# Altium schematic sheet PROC106B_AOP_PWR.SchDoc: AOP_POWER
size 431 x 279 mm; Date: Not shown in title block; ApprovedBy: Not shown in title block; CheckedBy: Not shown in title block; Author: Not shown in title block; CompanyName: Not shown in title block; DrawnBy: Antony/Anand Ram; Engineer: Not shown in title block; Organization: Not shown in title block; Address1: Not shown in title block; Address2: Not shown in title block; Address3: Not shown in title block; Address4: Not shown in title block; DocumentNumber: 4; Revision: Use project parameter SCH_Rev; SheetNumber: 4; SheetTotal: 12; PageSetup: Record=PageOptions|CenterHorizontal=True|CenterVertical=True|PrintScale=1.00|XCorrection=1.00|YCorrection=1.00|PrintKind=0|BorderSize=5000000|LeftOffset=0|BottomOffset=0|Orientation=2|PaperLength=1000|PaperWidth=1000|Scale=100|PaperSource=15|PrintQuality=600|MediaType=1|DitherType=10|PaperKind=Letter|PrintScaleMode=1; CurrentTime: Not shown in title block; CurrentDate: Not shown in title block; Time: Not shown in title block; DocumentFullPathAndName: Not shown in title block; DocumentName: Not shown in title block; ModifiedDate: Not shown in title block; ImagePath: Not shown in title block
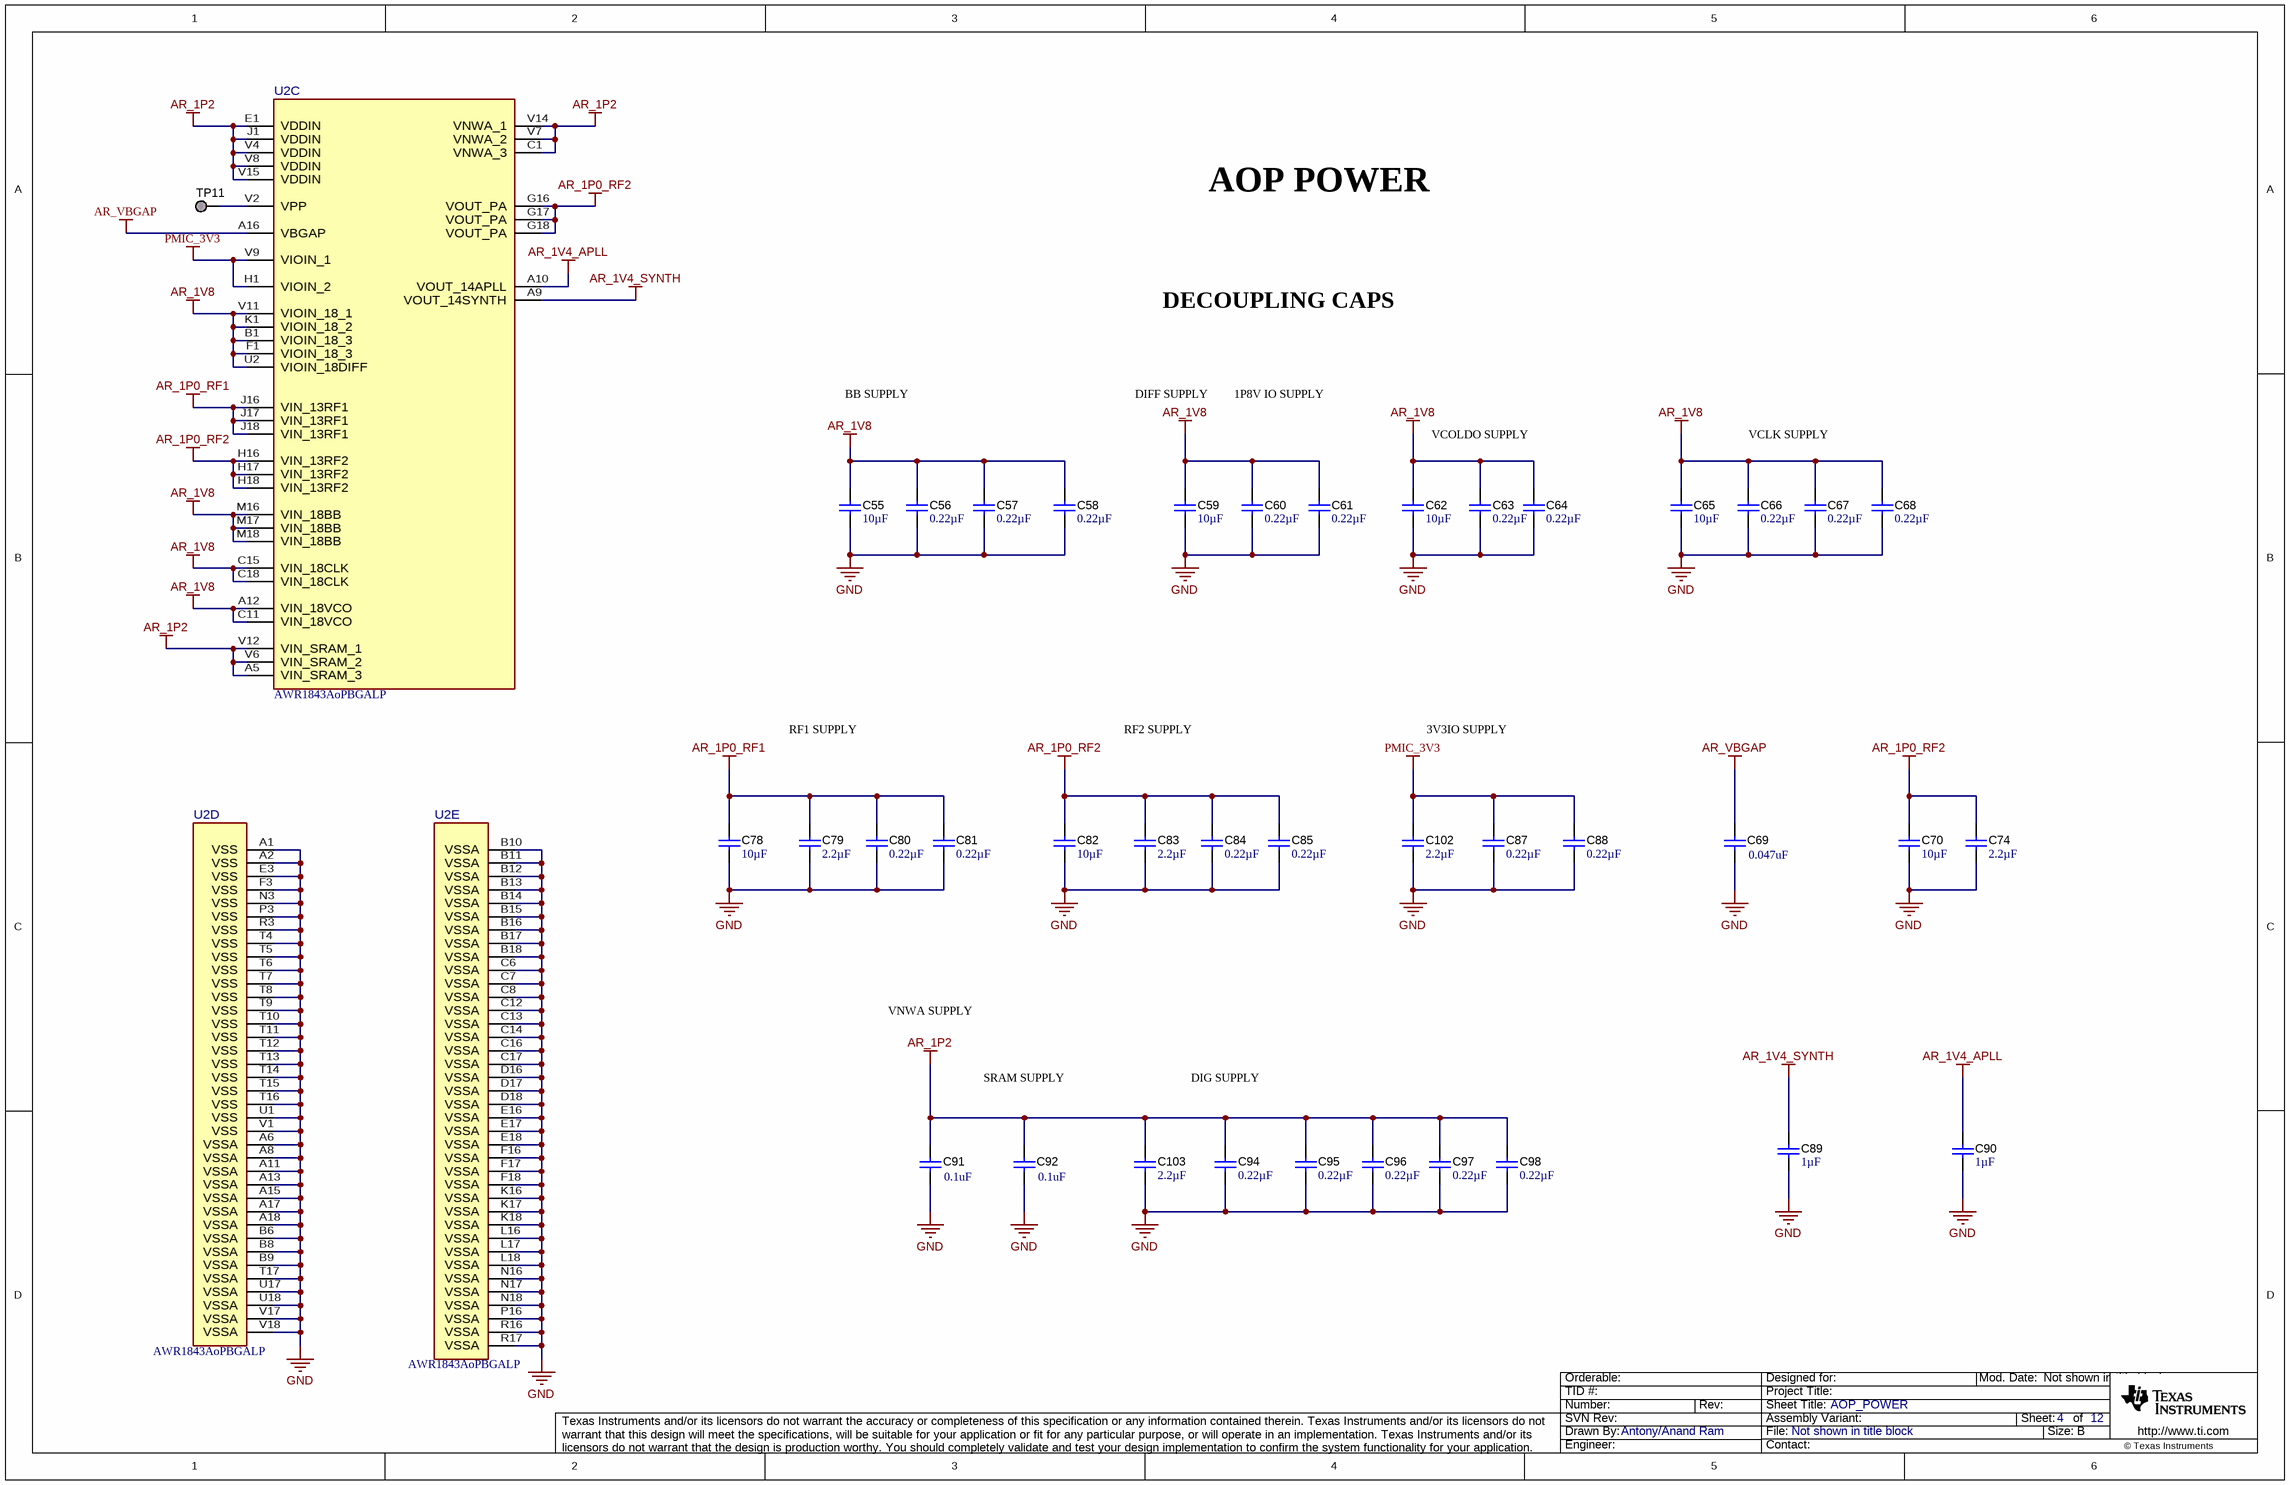
[diagram p0: PROC106B_AOP_PWR.SchDoc]

## Parts
C55  Cap_F: 10µF  [0805L]  (hidden comment: GCM21BR71A106KE22L)
C56  ValueDisplayed: 0.22µF  [0402L]  (hidden comment: GCM155R71C224KE02D)
C57  ValueDisplayed: 0.22µF  [0402L]  (hidden comment: GCM155R71C224KE02D)
C58  ValueDisplayed: 0.22µF  [0402L]  (hidden comment: GCM155R71C224KE02D)
C59  Cap_F: 10µF  [0805L]  (hidden comment: GCM21BR71A106KE22L)
C60  ValueDisplayed: 0.22µF  [0402L]  (hidden comment: GCM155R71C224KE02D)
C61  ValueDisplayed: 0.22µF  [0402L]  (hidden comment: GCM155R71C224KE02D)
C62  Cap_F: 10µF  [0805L]  (hidden comment: GCM21BR71A106KE22L)
C63  ValueDisplayed: 0.22µF  [0402L]  (hidden comment: GCM155R71C224KE02D)
C64  ValueDisplayed: 0.22µF  [0402L]  (hidden comment: GCM155R71C224KE02D)
C65  Cap_F: 10µF  [0805L]  (hidden comment: GCM21BR71A106KE22L)
C66  ValueDisplayed: 0.22µF  [0402L]  (hidden comment: GCM155R71C224KE02D)
C67  ValueDisplayed: 0.22µF  [0402L]  (hidden comment: GCM155R71C224KE02D)
C68  ValueDisplayed: 0.22µF  [0402L]  (hidden comment: GCM155R71C224KE02D)
C69  ValueDisplayed: 0.047uF  [0402L]  (hidden comment: CGA2B3X7R1H473K050BB)
C70  Cap_F: 10µF  [0805L]  (hidden comment: GCM21BR71A106KE22L)
C74  Cap_F: 2.2µF  [0603L]  (hidden comment: GCM188R70J225KE22D)
C78  Cap_F: 10µF  [0805L]  (hidden comment: GCM21BR71A106KE22L)
C79  Cap_F: 2.2µF  [0603L]  (hidden comment: GCM188R70J225KE22D)
C80  ValueDisplayed: 0.22µF  [0402L]  (hidden comment: GCM155R71C224KE02D)
C81  ValueDisplayed: 0.22µF  [0402L]  (hidden comment: GCM155R71C224KE02D)
C82  Cap_F: 10µF  [0805L]  (hidden comment: GCM21BR71A106KE22L)
C83  Cap_F: 2.2µF  [0603L]  (hidden comment: GCM188R70J225KE22D)
C84  ValueDisplayed: 0.22µF  [0402L]  (hidden comment: GCM155R71C224KE02D)
C85  ValueDisplayed: 0.22µF  [0402L]  (hidden comment: GCM155R71C224KE02D)
C87  ValueDisplayed: 0.22µF  [0402L]  (hidden comment: GCM155R71C224KE02D)
C88  ValueDisplayed: 0.22µF  [0402L]  (hidden comment: GCM155R71C224KE02D)
C89  Cap_F: 1µF  [0603L]  (hidden comment: GCM188R71C105KA64D)
C90  Cap_F: 1µF  [0603L]  (hidden comment: GCM188R71C105KA64D)
C91  ValueDisplayed: 0.1uF  [0402L]  (hidden comment: GCM155R71C104KA55D)
C92  ValueDisplayed: 0.1uF  [0402L]  (hidden comment: GCM155R71C104KA55D)
C94  ValueDisplayed: 0.22µF  [0402L]  (hidden comment: GCM155R71C224KE02D)
C95  ValueDisplayed: 0.22µF  [0402L]  (hidden comment: GCM155R71C224KE02D)
C96  ValueDisplayed: 0.22µF  [0402L]  (hidden comment: GCM155R71C224KE02D)
C97  ValueDisplayed: 0.22µF  [0402L]  (hidden comment: GCM155R71C224KE02D)
C98  ValueDisplayed: 0.22µF  [0402L]  (hidden comment: GCM155R71C224KE02D)
C102  Cap_F: 2.2µF  [0603L]  (hidden comment: GCM188R70J225KE22D)
C103  Cap_F: 2.2µF  [0603L]  (hidden comment: GCM188R70J225KE22D)
TP11  TP_SM_1MM  [TP_SM_1MM]  (value not drawn)  (no BOM)
U2  AWR1843AoPBGALP  [ALP0180A-MFG]  (parts C,D,E of 5)

## Nets
AR_1P0_RF1: C78.1 C79.1 C80.1 C81.1 U2.J16(VIN_13RF1) U2.J17(VIN_13RF1) U2.J18(VIN_13RF1)
AR_1P0_RF2: C70.1 C74.1 C82.1 C83.1 C84.1 C85.1 U2.G16(VOUT_PA) U2.G17(VOUT_PA) U2.G18(VOUT_PA) U2.H16(VIN_13RF2) U2.H17(VIN_13RF2) U2.H18(VIN_13RF2)
AR_1P2: C91.2 C92.2 C94.1 C95.1 C96.1 C97.1 C98.1 C103.1 U2.A5(VIN_SRAM_3) U2.C1(VNWA_3) U2.E1(VDDIN) U2.J1(VDDIN) U2.V4(VDDIN) U2.V6(VIN_SRAM_2) U2.V7(VNWA_2) U2.V8(VDDIN) U2.V12(VIN_SRAM_1) U2.V14(VNWA_1) U2.V15(VDDIN)
AR_1V4_APLL: C90.1 U2.A10(VOUT_14APLL)
AR_1V4_SYNTH: C89.1 U2.A9(VOUT_14SYNTH)
AR_1V8: C55.1 C56.1 C57.1 C58.1 C59.1 C60.1 C61.1 C62.1 C63.1 C64.1 C65.1 C66.1 C67.1 C68.1 U2.A12(VIN_18VCO) U2.B1(VIOIN_18_3) U2.C11(VIN_18VCO) U2.C15(VIN_18CLK) U2.C18(VIN_18CLK) U2.F1(VIOIN_18_3) U2.K1(VIOIN_18_2) U2.M16(VIN_18BB) U2.M17(VIN_18BB) U2.M18(VIN_18BB) U2.U2(VIOIN_18DIFF) U2.V11(VIOIN_18_1)
AR_VBGAP: C69.1 U2.A16(VBGAP)
GND: C55.2 C56.2 C57.2 C58.2 C59.2 C60.2 C61.2 C62.2 C63.2 C64.2 C65.2 C66.2 C67.2 C68.2 C69.2 C70.2 C74.2 C78.2 C79.2 C80.2 C81.2 C82.2 C83.2 C84.2 C85.2 C87.2 C88.2 C89.2 C90.2 C91.1 C92.1 C94.2 C95.2 C96.2 C97.2 C98.2 C102.2 C103.2 U2.A1(VSS) U2.A2(VSS) U2.A6(VSSA) U2.A8(VSSA) U2.A11(VSSA) U2.A13(VSSA) U2.A15(VSSA) U2.A17(VSSA) U2.A18(VSSA) U2.B6(VSSA) U2.B8(VSSA) U2.B9(VSSA) U2.B10(VSSA) U2.B11(VSSA) U2.B12(VSSA) U2.B13(VSSA) U2.B14(VSSA) U2.B15(VSSA) U2.B16(VSSA) U2.B17(VSSA) U2.B18(VSSA) U2.C6(VSSA) U2.C7(VSSA) U2.C8(VSSA) U2.C12(VSSA) U2.C13(VSSA) U2.C14(VSSA) U2.C16(VSSA) U2.C17(VSSA) U2.D16(VSSA) U2.D17(VSSA) U2.D18(VSSA) U2.E3(VSS) U2.E16(VSSA) U2.E17(VSSA) U2.E18(VSSA) U2.F3(VSS) U2.F16(VSSA) U2.F17(VSSA) U2.F18(VSSA) U2.K16(VSSA) U2.K17(VSSA) U2.K18(VSSA) U2.L16(VSSA) U2.L17(VSSA) U2.L18(VSSA) U2.N3(VSS) U2.N16(VSSA) U2.N17(VSSA) U2.N18(VSSA) U2.P3(VSS) U2.P16(VSSA) U2.R3(VSS) U2.R16(VSSA) U2.R17(VSSA) U2.T4(VSS) U2.T5(VSS) U2.T6(VSS) U2.T7(VSS) U2.T8(VSS) U2.T9(VSS) U2.T10(VSS) U2.T11(VSS) U2.T12(VSS) U2.T13(VSS) U2.T14(VSS) U2.T15(VSS) U2.T16(VSS) U2.T17(VSSA) U2.U1(VSS) U2.U17(VSSA) U2.U18(VSSA) U2.V1(VSS) U2.V17(VSSA) U2.V18(VSSA)
PMIC_3V3: C87.1 C88.1 C102.1 U2.H1(VIOIN_2) U2.V9(VIOIN_1)
NetTP11_1: TP11.1 U2.V2(VPP)

## Notes on the sheet
- AOP POWER
- DECOUPLING CAPS
- BB SUPPLY
- DIFF SUPPLY
- 1P8V IO SUPPLY
- VCOLDO SUPPLY
- VCLK SUPPLY
- RF1 SUPPLY
- RF2 SUPPLY
- 3V3IO SUPPLY
- VNWA SUPPLY
- SRAM SUPPLY
- DIG SUPPLY
- Drawn By:
- SVN Rev:
- Number:
- TID #:
- Orderable:
- Rev:
- Sheet Title:
- File:
- Project Title:
- Designed for:
- Assembly Variant:
- Mod. Date:
- Sheet:
- Size:
- of
- B
- http://www.ti.com
- Texas Instruments and/or its licensors do not warrant the accuracy or completeness of this specification or any information contained therein. Texas Instruments and/or its licensors do not warrant that this design will meet the specifications, will be suitable for your application or fit for any particular purpose, or will operate in an implementation. Texas Instruments and/or its licensors do not warrant that the design is production worthy. You should completely validate and test your design implementation to confirm the system functionality for your application.
- Engineer:
- Contact:
- © Texas Instruments

## Library data of the parts
C55 C59 C62 C65 C70 C78 C82 = CMP-0008017-2: CAP, CERM, 10 uF, 10 V, +/- 10%, X7R, 0805; Manufacturer: MuRata; Value: 10uF; AEC Category: Q200; Cap_Case: 0805; Polarized: N; SizeArea_mm2: 2.5; SizeAreaWB_mm2: 6.75; SizeX_mm: 2; SizeY_mm: 1.25; SizeZ_mm: 1.45; TaMax_C: 125°C; TaMin_C: -55°C; U/M: EA; Value1: Unknown; Value2: 10V; RoHS: Y; AEC Qualified: ?; ComponentLink1Description: Datasheet link; ComponentLink1URL: http://www.murata.com/products/catalog/pdf/c03e.pdf; CompType: Capacitor; MountType: SMT; PackageReference: 0805; PartNumber: GCM21BR71A106KE22L; Supplier 1: Digi-Key; Supplier 2: Newark; Supplier 3: Mouser; Supplier Part Number 1: 490-10674-1-ND; Supplier Part Number 2: 06AC6014; Supplier Part Number 3: 81-GCM21BR71A106KE2L; Technology: Ceramic; TempCo: X7R; Tolerance_%: 10%; ValueDisplayed: 10uF; VDC_V: 10V; LatestRevisionDate: 2017-03-09; Published: 2008-06-19; Publisher: Texas Instruments
C56-C58 C60 C61 C63 C64 C66-C68 C80 C81 C84 C85 C87 C88 C94-C98 = CMP-0078265-1: CAP, CERM, 0.22 µF, 16 V,+/- 10%, X7R, AEC-Q200 Grade 1, 0402; Manufacturer: MuRata; Value: 0.22uF; AEC Category: Q200; AEC Grade: 1; AEC Qualified: Y; Cap_Case: 0402; Cap_F: 220nF; Polarized: N; SizeArea_mm2: 0.5; SizeAreaWB_mm2: 3; SizeZ_mm: 0.6; TaMax_C: 125°C; TaMin_C: -55°C; U/M: EA; Value2: 16V; RoHS: Y; ComponentLink1Description: Datasheet link; ComponentLink1URL: http://psearch.en.murata.com/capacitor/product/GCM155R71C224KE02%23.pdf; CompType: Capacitor; MountType: SMT; PackageReference: 0402; PartNumber: GCM155R71C224KE02D; SizeX_mm: 1; SizeY_mm: 0.5; Supplier 1: Digi-Key; Supplier 2: Mouser; Supplier Part Number 1: 490-10671-1-ND; Supplier Part Number 2: 81-GCM155R71C224KE2D; Technology: Ceramic; TempCo: X7R; Tolerance_%: 10%; VDC_V: 16V
C69 = CMP-0006330-2: CAP, CERM, 0.047 uF, 50 V, +/- 10%, X7R, AEC-Q200 Grade 1, 0402; Manufacturer: TDK; SizeZ_mm: 0.6; AEC Qualified: Y; Cap_F: 47nF; VDC_V: 50V; AEC Grade: 1; AEC Category: Q200; Cap_Case: 0402; ESR_ohm: 0.06407; IRMS_A: 6.46122dA; Polarized: N; SizeArea_mm2: 0.5; SizeAreaWB_mm2: 3; TaMax_C: 125°C; TaMin_C: -55°C; U/M: EA; Value1: 0.06407 ohm; Supplier Part Number 2: 810-CGA2B3X7R1H473K050BB; Supplier 2: Mouser; TempCo: X7R; RoHS: Y; Supplier 1: Digi-Key; PackageReference: 0402; Tolerance_%: 10%; PartNumber: CGA2B3X7R1H473K050BB; ComponentLink1Description: Datasheet link; Supplier Part Number 1: 445-6897-1-ND; ComponentLink1URL: https://product.tdk.com/en/search/capacitor/ceramic/mlcc/info?part_no=CGA2B3X7R1H473K050BB; CompType: Capacitor; LatestRevisionDate: 2017-03-09; MountType: SMT; Published: 2008-06-19; Publisher: Texas Instruments; SizeX_mm: 1; SizeY_mm: 0.5; Technology: Ceramic; Value2: 50V; Value: 0.047uF
C74 C79 C83 C102 C103 = CMP-0007134-5: CAP, CERM, 2.2 uF, 6.3 V, +/- 10%, X7R, AEC-Q200 Grade 1, 0603; Manufacturer: MuRata; Value: 2.2uF; AEC Category: Q200; AEC Grade: 1; AEC Qualified: Y; Cap_Case: 0603; Polarized: N; SizeArea_mm2: 1.28; SizeAreaWB_mm2: 4.68; SizeX_mm: 1.6; SizeY_mm: 0.8; TaMax_C: 125°C; TaMin_C: -55°C; U/M: EA; Value1: Unknown; Value2: 6.3V; RoHS: Y; ComponentLink1Description: Datasheet link; ComponentLink1URL: http://psearch.en.murata.com/capacitor/product/GCM188R70J225KE22%23.pdf; CompType: Capacitor; MountType: SMT; PackageReference: 0603; PartNumber: GCM188R70J225KE22D; SizeZ_mm: 1; Supplier 1: Digi-Key; Supplier 2: Mouser; Supplier Part Number 1: 490-5316-1-ND; Supplier Part Number 2: 81-GCM188R70J225KE2D; Technology: Ceramic; TempCo: X7R; Tolerance_%: 10%; ValueDisplayed: 2.2uF; VDC_V: 6.3V; LatestRevisionDate: 2017-03-09; Published: 2008-06-19; Publisher: Texas Instruments
C89 C90 = CMP-0007136-5: CAP, CERM, 1 uF, 16 V, +/- 10%, X7R, AEC-Q200 Grade 1, 0603; Manufacturer: MuRata; TaMin_C: -55°C; Polarized: N; SizeAreaWB_mm2: 4.68; U/M: EA; Value: 1uF; TaMax_C: 125°C; SizeZ_mm: 1; SizeX_mm: 1.6; SizeY_mm: 0.8; Cap_Case: 0603; Value2: 16V; SizeArea_mm2: 1.28; AEC Qualified: Y; AEC Category: Q200; Value1: Unknown; ComponentLink1URL: http://psearch.en.murata.com/capacitor/product/GCM188R71C105KA64%23.pdf; Supplier Part Number 2: 81-GCM188R71C105K64D; Supplier 2: Mouser; TempCo: X7R; RoHS: Y; MountType: SMT; Supplier 1: Digi-Key; PackageReference: 0603; Tolerance_%: 10%; CompType: Capacitor; PartNumber: GCM188R71C105KA64D; VDC_V: 16V; ComponentLink1Description: Datasheet link; AEC Grade: 1; Supplier Part Number 1: 490-5241-6-ND; Technology: Ceramic; ValueDisplayed: 1uF; LatestRevisionDate: 2017-03-09; Published: 2008-06-19; Publisher: Texas Instruments
C91 C92 = CMP-0006351-2: CAP, CERM, 0.1 uF, 16 V, +/- 10%, X7R, 0402; Manufacturer: MuRata; Cap_F: 100nF; SizeZ_mm: 0.6; VDC_V: 16V; AEC Category: Q200; Cap_Case: 0402; Polarized: N; SizeArea_mm2: 0.5; SizeAreaWB_mm2: 3; SizeX_mm: 1; TaMax_C: 125°C; TaMin_C: -55°C; U/M: EA; Value1: Unknown; Value: 0.1uF; RoHS: Y; AEC Qualified: ?; ComponentLink1Description: Datasheet link; ComponentLink1URL: http://psearch.murata.com/capacitor/product/GCM155R71C104KA55%23.pdf; PackageReference: 0402; PartNumber: GCM155R71C104KA55D; TempCo: X7R; Tolerance_%: 10%; CompType: Capacitor; MountType: SMT; SizeY_mm: 0.5; Supplier 1: Digi-Key; Supplier Part Number 1: 490-4759-2-ND; Technology: Ceramic; Value2: 16V; LatestRevisionDate: 2017-03-09; Published: 2008-06-19; Publisher: Texas Instruments
TP11 = CMP-0003825-1: 1mm Test Point, SMT; Manufacturer: Any; ComponentLink1URL: https://sps06.itg.ti.com/sites/KMS/crossdivteams/altium/docs/ComponentDatasheets/PROBE_TEST_POINT.png; Key: TP_SM_1MM; Publisher: Texas Instruments; CompType: Test Point; PackageReference: 1mm Test Point, SMT; LatestRevisionDate: 2017-03-09; MountType: SMT; PartNumber: TP_SM_1MM; ComponentLink1Description: Datasheet Link
U2 = CMP-0090288-2: Manufacturer: Texas Instruments; Standoff Height: 0.31mm; SizeZ_mm: 0.965mm; AEC Category: Q200; CompType: IC; PackageReference: FCBGA180; helpURL: https://upverter.com/upn/revision/1d9228af6d9453a7/; RoHS: UNKNOWN; Datasheet Path: datasheets/IC-AWR1843AoPBGALP.pdf; Operating Temperature Range: to; PartNumber: AWR1843AoPBGALP; Part Number: AWR1843AoPBGALP; ComponentLink1Description: Datasheet Link; ComponentLink1URL: http://www.ti.com/lit/ds/symlink/GPN.pdf; ComponentLink2Description: Product Folder; ComponentLink2URL: http://www.ti.com/product/GPN; ComponentLink3Description: Online Datasheet; ComponentLink3URL: http://www.ti.com/product/GPN/datasheet